# Altium schematic sheet 11_USB.schdoc.schdoc
size 309 x 223 mm; Symbol: Sheet-Symbol_A4; Device: Sheet-Symbol_A4; @Page Name: USB; @Create Date: 2023-11-30; @Page Count: 13; @Page No: 4; @Project Name: STM32F722RET6; @Schematic Name: 开发板; @Update Date: 2023-12-01; Company: 嘉立创EDA; Page Size: A4; Version: V1.0
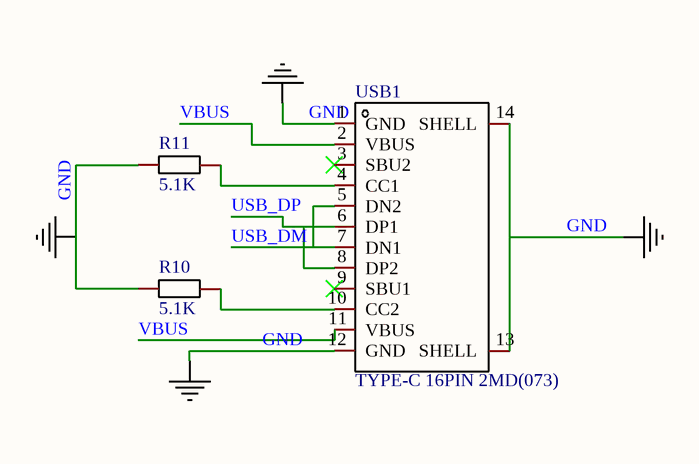
[diagram p0: 11_USB.schdoc.schdoc]

## Parts
R10  5.1K  [R0603]
R11  5.1K  [R0603]
USB1  TYPE-C 16PIN 2MD(073)  [USB-C-SMD_TYPE-C-6PIN-2MD-073]

## Nets
GND: R10.1 R11.1 USB1.1(GND) USB1.12(GND) USB1.13(SHELL) USB1.14(SHELL)
USB_DM: USB1.5(DN2) USB1.7(DN1)
USB_DP: USB1.6(DP1) USB1.8(DP2)
VBUS: USB1.2(VBUS) USB1.11(VBUS)
NetR10_2: R10.2 USB1.10(CC2)
NetR11_2: R11.2 USB1.4(CC1)

Not connected (* = marked no-connect by the designer): USB1 3(SBU2)* 9(SBU1)*

## Notes on the sheet
- 1
- 2
- 3
- 4
- 5
- 6
- A
- B
- C
- 原理图
- 开发板
- 创建日期
- 更新日期
- 2023-11-30
- 2023-12-01
- 审阅
- 绘制
- 图页
- USB
- 物料编码
- STM32F722RET6
- D
- 版本
- 尺寸
- 页
- 共
- 13
- V1.0
- A4
- 嘉立创EDA

## Library data of the parts
R10 R11 = Res_0603: Symbol: 电阻; Convert to PCB: yes; Name: 5.1K; Device: Res_0603; Add into BOM: yes; Supplier Footprint: 0603; Value: 5.1K
USB1 = TYPE-C 16PIN 2MD(073): 连接器类型:Type-C;标准:-;公母:母;触点数量:16P;端口数量:1;安装方式:卧贴;额定电流 - 电源:5A;工作温度范围:-25℃~+85℃;; Manufacturer: SHOU HAN(首韩); Add into BOM: yes; Gender: 母; Number of Contacts: 16P; Number of Ports: 1; Current Rating - Power (Max): 5A; Name: TYPE-C 16PIN 2MD(073); Symbol: TYPE-C 16PIN 2MD(073); Device: TYPE-C 16PIN 2MD(073); LCSC Part Name: Type-C 母 卧贴 带定位柱 不锈钢外壳 2次模顶; Supplier Part: C2765186; Manufacturer Part: TYPE-C 16PIN 2MD(073); Supplier Footprint: SMD; JLCPCB Part Class: 扩展库; Datasheet: https://atta.szlcsc.com/upload/public/pdf/source/20211123/39B17C16241EAC15C5E277BDA434118E.pdf; Supplier: LCSC; Convert to PCB: yes; Connector Type: Type-C; Standard: -; Mounting Style: 卧贴; Operating Temperature Range: -25℃~+85℃